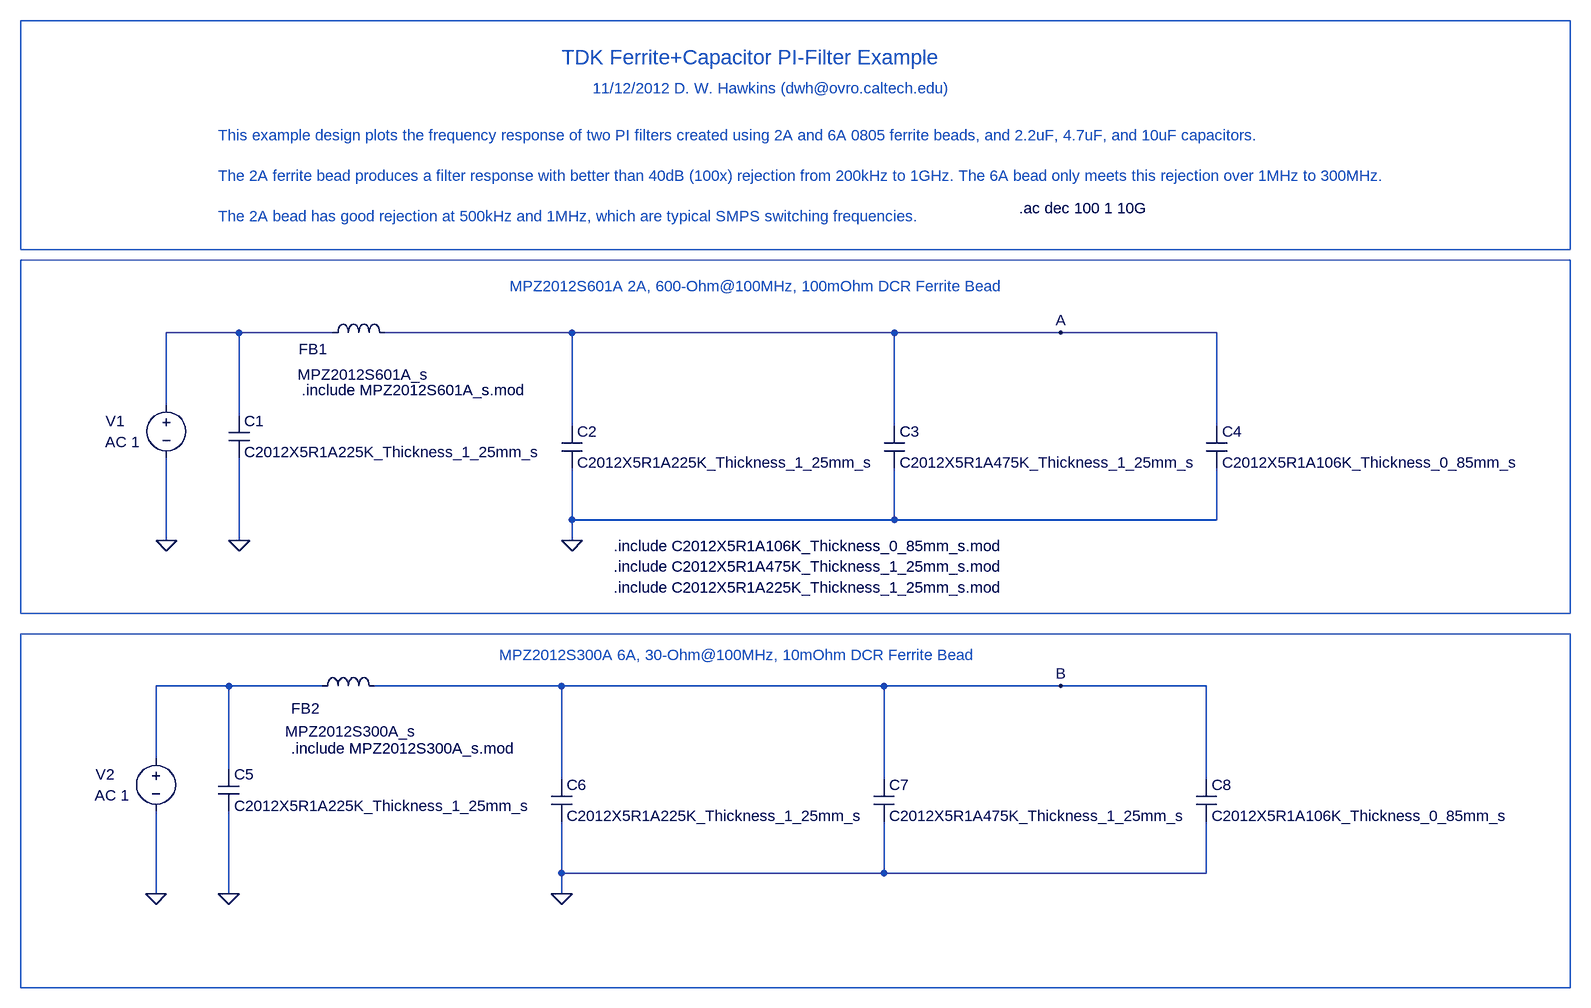
[diagram p0: schematic TDK_pi_filter.asc]
TDK_pi_filter.asc, the LTspice schematic file:
Version 4
SHEET 1 2444 1604
WIRE 304 -48 192 -48
WIRE 448 -48 304 -48
WIRE 816 -48 528 -48
WIRE 1312 -48 816 -48
WIRE 1568 -48 1312 -48
WIRE 1808 -48 1568 -48
WIRE 192 64 192 -48
WIRE 304 80 304 -48
WIRE 816 96 816 -48
WIRE 1312 96 1312 -48
WIRE 1808 96 1808 -48
WIRE 816 240 816 160
WIRE 1312 240 1312 160
WIRE 1312 240 816 240
WIRE 1808 240 1808 160
WIRE 1808 240 1312 240
WIRE 192 272 192 144
WIRE 304 272 304 144
WIRE 816 272 816 240
WIRE 288 496 176 496
WIRE 432 496 288 496
WIRE 800 496 512 496
WIRE 1296 496 800 496
WIRE 1568 496 1296 496
WIRE 1792 496 1568 496
WIRE 176 608 176 496
WIRE 288 624 288 496
WIRE 800 640 800 496
WIRE 1296 640 1296 496
WIRE 1792 640 1792 496
WIRE 800 784 800 704
WIRE 1296 784 1296 704
WIRE 1296 784 800 784
WIRE 1792 784 1792 704
WIRE 1792 784 1296 784
WIRE 176 816 176 688
WIRE 288 816 288 688
WIRE 800 816 800 784
FLAG 192 272 0
FLAG 304 272 0
FLAG 816 272 0
FLAG 176 816 0
FLAG 288 816 0
FLAG 800 816 0
FLAG 1568 -48 A
FLAG 1568 496 B
SYMBOL ind 432 -32 R270
WINDOW 0 -25 -14 VTop 2
WINDOW 3 -33 63 VBottom 2
SYMATTR InstName FB1
SYMATTR Value MPZ2012S601A_s
SYMATTR Prefix X
SYMBOL cap 800 96 R0
SYMATTR InstName C2
SYMATTR Value C2012X5R1A225K_Thickness_1_25mm_s
SYMATTR Prefix X
SYMBOL cap 1296 96 R0
SYMATTR InstName C3
SYMATTR Value C2012X5R1A475K_Thickness_1_25mm_s
SYMATTR Prefix X
SYMBOL cap 1792 96 R0
SYMATTR InstName C4
SYMATTR Value C2012X5R1A106K_Thickness_0_85mm_s
SYMATTR Prefix X
SYMBOL cap 288 80 R0
SYMATTR InstName C1
SYMATTR Value C2012X5R1A225K_Thickness_1_25mm_s
SYMATTR Prefix X
SYMBOL voltage 192 48 R0
WINDOW 0 -93 40 Left 2
WINDOW 123 -94 72 Left 2
WINDOW 39 0 0 Left 2
SYMATTR InstName V1
SYMATTR Value2 AC 1
SYMATTR Value ""
SYMBOL ind 416 512 R270
WINDOW 0 -34 -10 VTop 2
WINDOW 3 -38 60 VBottom 2
SYMATTR InstName FB2
SYMATTR Value MPZ2012S300A_s
SYMATTR Prefix X
SYMBOL cap 784 640 R0
SYMATTR InstName C6
SYMATTR Value C2012X5R1A225K_Thickness_1_25mm_s
SYMATTR Prefix X
SYMBOL cap 1280 640 R0
SYMATTR InstName C7
SYMATTR Value C2012X5R1A475K_Thickness_1_25mm_s
SYMATTR Prefix X
SYMBOL cap 1776 640 R0
SYMATTR InstName C8
SYMATTR Value C2012X5R1A106K_Thickness_0_85mm_s
SYMATTR Prefix X
SYMBOL cap 272 624 R0
SYMATTR InstName C5
SYMATTR Value C2012X5R1A225K_Thickness_1_25mm_s
SYMATTR Prefix X
SYMBOL voltage 176 592 R0
WINDOW 0 -93 40 Left 2
WINDOW 123 -94 72 Left 2
WINDOW 39 0 0 Left 2
SYMATTR InstName V2
SYMATTR Value2 AC 1
SYMATTR Value ""
TEXT 1504 -240 Left 2 !.ac dec 100 1 10G
TEXT 400 40 Left 2 !.include MPZ2012S601A_s.mod
TEXT 720 -120 Left 2 ;MPZ2012S601A 2A, 600-Ohm@100MHz, 100mOhm DCR Ferrite Bead
TEXT 704 448 Left 2 ;MPZ2012S300A 6A, 30-Ohm@100MHz, 10mOhm DCR Ferrite Bead
TEXT 800 -472 Left 3 ;TDK Ferrite+Capacitor PI-Filter Example
TEXT 848 -424 Left 2 ;11/12/2012 D. W. Hawkins (dwh@ovro.caltech.edu)
TEXT 272 -352 Left 2 ;This example design plots the frequency response of two PI filters created using 2A and 6A 0805 ferrite beads, and 2.2uF, 4.7uF, and 10uF capacitors.\n \nThe 2A ferrite bead produces a filter response with better than 40dB (100x) rejection from 200kHz to 1GHz. The 6A bead only meets this rejection over 1MHz to 300MHz.\n \nThe 2A bead has good rejection at 500kHz and 1MHz, which are typical SMPS switching frequencies.
TEXT 880 312 Left 2 !.include C2012X5R1A475K_Thickness_1_25mm_s.mod
TEXT 880 344 Left 2 !.include C2012X5R1A225K_Thickness_1_25mm_s.mod
TEXT 880 280 Left 2 !.include C2012X5R1A106K_Thickness_0_85mm_s.mod
TEXT 384 592 Left 2 !.include MPZ2012S300A_s.mod
RECTANGLE Normal 2352 384 -32 -160
RECTANGLE Normal 2352 -176 -32 -528
RECTANGLE Normal 2352 960 -32 416

The netlist it stands for:
* TDK_pi_filter.asc
XFB1 N001 A MPZ2012S601A_s  ; pins A B
XC2 A 0 C2012X5R1A225K_Thickness_1_25mm_s  ; pins A B
XC3 A 0 C2012X5R1A475K_Thickness_1_25mm_s  ; pins A B
XC4 A 0 C2012X5R1A106K_Thickness_0_85mm_s  ; pins A B
XC1 N001 0 C2012X5R1A225K_Thickness_1_25mm_s  ; pins A B
V1 N001 0 AC 1
XFB2 N002 B MPZ2012S300A_s  ; pins A B
XC6 B 0 C2012X5R1A225K_Thickness_1_25mm_s  ; pins A B
XC7 B 0 C2012X5R1A475K_Thickness_1_25mm_s  ; pins A B
XC8 B 0 C2012X5R1A106K_Thickness_0_85mm_s  ; pins A B
XC5 N002 0 C2012X5R1A225K_Thickness_1_25mm_s  ; pins A B
V2 N002 0 AC 1
.ac dec 100 1 10G
.include MPZ2012S601A_s.mod
* MPZ2012S601A 2A, 600-Ohm@100MHz, 100mOhm DCR Ferrite Bead
* MPZ2012S300A 6A, 30-Ohm@100MHz, 10mOhm DCR Ferrite Bead
* TDK Ferrite+Capacitor PI-Filter Example
* 11/12/2012 D. W. Hawkins (dwh@ovro.caltech.edu)
* This example design plots the frequency response of two PI filters created using 2A and 6A 0805 ferrite beads, and 2.2uF, 4.7uF, and 10uF capacitors.
* The 2A ferrite bead produces a filter response with better than 40dB (100x) rejection from 200kHz to 1GHz. The 6A bead only meets this rejection over 1MHz to 300MHz.
* The 2A bead has good rejection at 500kHz and 1MHz, which are typical SMPS switching frequencies.
.include C2012X5R1A475K_Thickness_1_25mm_s.mod
.include C2012X5R1A225K_Thickness_1_25mm_s.mod
.include C2012X5R1A106K_Thickness_0_85mm_s.mod
.include MPZ2012S300A_s.mod
.backanno
.end